# EAGLE design co2-sensor (EAGLE 9.6.2)
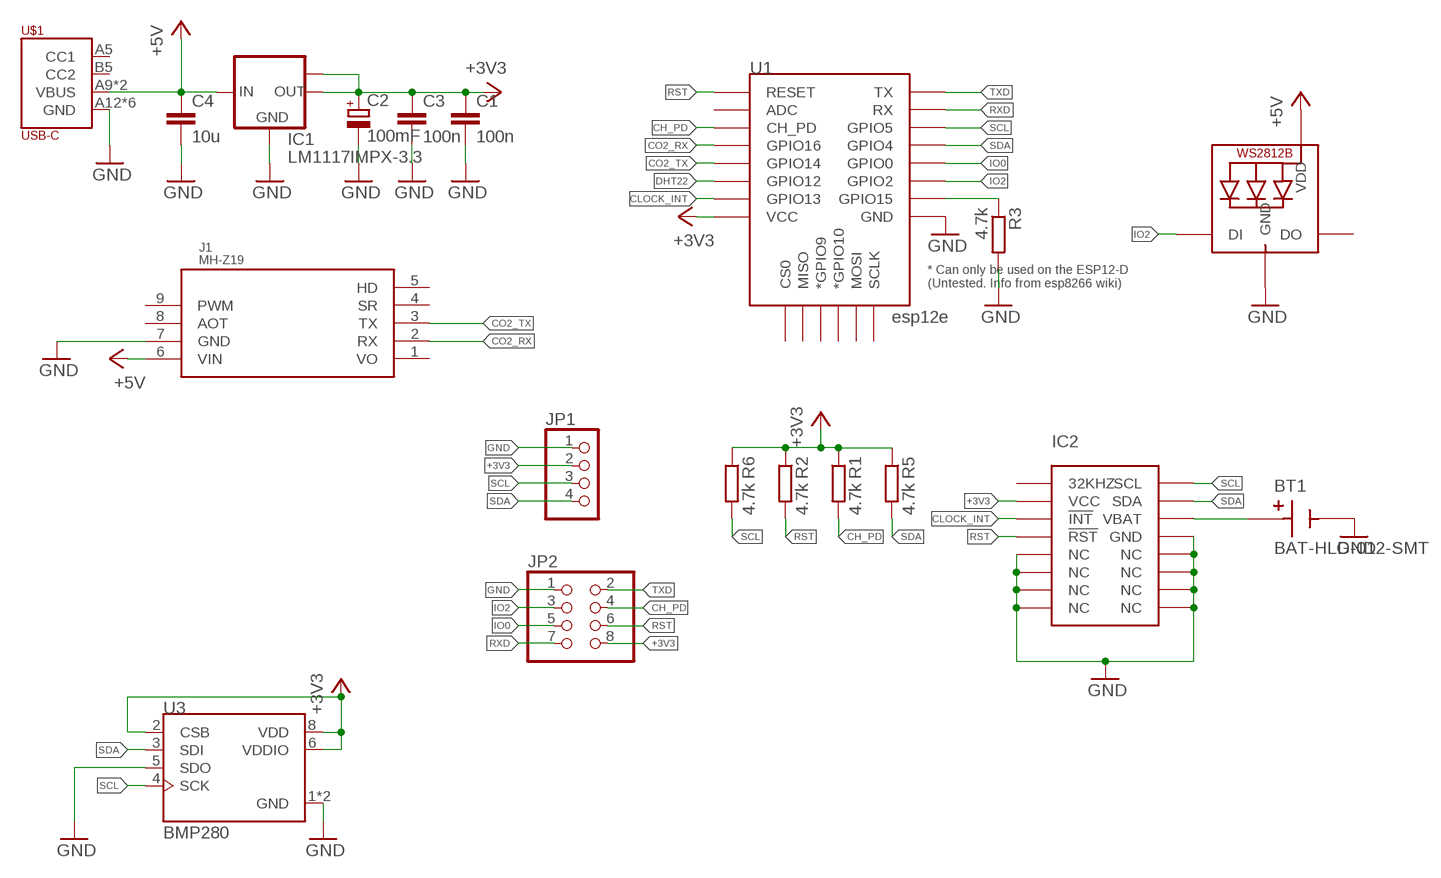
[diagram p0: schematic, sheet 1]

## Parts
BT1  BAT-HLD-012-SMT  [BAT_BAT-HLD-012-SMT]
C1  100n  C-EUC0805  [C0805]
C2  100mF  CPOL-EUCT3216  [CT3216]
C3  100n  C-EUC0805  [C0805]
C4  10u  C-EUC0805  [C0805]
IC1  LM1117IMPX-3.3  [SOT223]
IC2  DS3231SOIC-16W  [SOIC-16W]
J1  MH-Z19  [MH-Z19-REV]
JP1  PINHD-1X4  [1X04]
JP2  PINHD-2X4  [2X04]
LED1  WS2812B5050  [WS2812B]
R1  4.7k  R-EU_M0805  [M0805]
R2  4.7k  R-EU_M0805  [M0805]
R3  4.7k  R-EU_M0805  [M0805]
R5  4.7k  R-EU_M0805  [M0805]
R6  4.7k  R-EU_M0805  [M0805]
U1  esp12e  ESP12ESMD  [ESP12E-SMD]
U3  BMP280  [XDCR_BMP280]
U$1  USB-C  [USB-C]

## Nets
+3V3 [+3.3V]: C1.1 C2.+ C3.1 IC1.2(OUT) IC1.TAB(OUT1) IC2.2(VCC) JP1.2 JP2.8 R1.1 R2.1 R5.1 R6.1 U1.VCC U3.2(CSB) U3.6(VDDIO) U3.8(VDD)
+5V [+5V]: C4.1 IC1.3(IN) J1.6(VIN) LED1.1-VDD(VDD) U$1.A9(VBUS) U$1.B9(VBUS)
CH_PD: JP2.4 R1.2 U1.CH_PD
CLOCK_INT: IC2.3(!INT) U1.GPIO13
CO2_RX: J1.2(RX) U1.GPIO16
CO2_TX: J1.3(TX) U1.GPIO14
DHT22: U1.GPIO12
GND [GND]: BT1.N C1.2 C2.- C3.2 C4.2 IC1.1(GND) IC2.5(NC) IC2.6(NC) IC2.7(NC) IC2.8(NC) IC2.9(NC) IC2.10(NC) IC2.11(NC) IC2.12(NC) IC2.13(GND) J1.7(GND) JP1.1 JP2.1 LED1.3-GND(GND) R3.2 U1.GND U3.1(GND) U3.5(SDO) U3.7(GND) U$1.A12(GND) U$1.B12(GND) U$1.P$7(GND) U$1.P$8(GND) U$1.P$9(GND) U$1.P$10(GND)
IO0: JP2.5 U1.GPIO0
IO2: JP2.3 LED1.4-DIN(DI) U1.GPIO2
N$1: R3.1 U1.GPIO15
N$6: BT1.P1(P) BT1.P2(P) IC2.14(VBAT)
RST: IC2.4(!RST) JP2.6 R2.2 U1.RESET
RXD: JP2.7 U1.RXD0(RX)
SCL: IC2.16(SCL) JP1.3 R6.2 U1.GPIO5 U3.4(SCK)
SDA: IC2.15(SDA) JP1.4 R5.2 U1.GPIO4 U3.3(SDI)
TXD: JP2.2 U1.TXD0(TX)
Unconnected: IC2.1(32KHZ) J1.4(SR) J1.5(HD) J1.8(AOT) J1.9(PWM) LED1.2-DOUT(DO) U1.ADC U1.CS0 U1.GPIO9(*GPIO9) U1.GPIO10(*GPIO10) U1.MISO U1.MOSI U1.SCLK U$1.A5(CC1) U$1.B5(CC2)

## Power pins joined to a net without a drawn wire
VO: J1.1(VO)

## Library data of the parts
BT1 = BAT-HLD-012-SMT:BAT-HLD-012-SMT: Check prices <https://pricing.snapeda.com/parts/BAT-HLD-012-SMT/Linx%20Technologies/view-part?ref=eda>; AVAILABILITY: Good; DESCRIPTION: Holder for CR1216 and CR1225 Batteries, Surface-Mount, Bulk Packaging; MF: Linx Technologies; MP: BAT-HLD-012-SMT; PACKAGE: NON-STANDARD-1 Linx Technologies; PRICE: None; PURCHASE-URL: https://pricing.snapeda.com/search/part/BAT-HLD-012-SMT/?ref=eda
C1 C3 C4 = rcl:C-EU: CAPACITOR, European symbol; SPICEPREFIX: C
C2 = rcl:CPOL-EU: POLARIZED CAPACITOR, European symbol; SPICEPREFIX: C
IC1 = lm1117:LM1117IMPX-*
IC2 = DS3231_industrialberry:DS3231
J1 = mh-z19:MH-Z19: MH-Z19 - CO2 NDIR SENSOR
JP1 = pinhead:PINHD-1X4: PIN HEADER
JP2 = pinhead:PINHD-2X4: PIN HEADER
LED1 = WS2812B:WS2812B; AVAILABILITY: Unavailable; DESCRIPTION: Intelligent Control Led Integrated Light Source Pack Of 10; MF: Worldsemi; MP: WS2812B; PACKAGE: None; PRICE: None
R1-R3 R5 R6 = rcl:R-EU_: RESISTOR, European symbol; SPICEPREFIX: R
U1 = esp8266modules:ESP12E: ESP12E Module
U3 = BMP280:BMP280: BMP280 Absolute Barometric Pressure Sensor for Battery Powered Devices 2 x 2.5mm Check prices <https://pricing.snapeda.com/parts/BMP280/Bosch/view-part?ref=eda>; AVAILABILITY: Warning; DESCRIPTION: Pressure Sensor 4.35PSI ~ 15.95PSI (30kPa ~ 110kPa) Absolute 16b 8-SMD; MF: Bosch; MP: BMP280; PACKAGE: SMD-8 Bosch Sensortec; PRICE: None; PURCHASE-URL: https://pricing.snapeda.com/search/part/BMP280/?ref=eda
U$1 = USB-C:USB-C

## Net classes
0 default: width 0.25 mm, clearance 0.205 mm
1 GND: width 0.8 mm, clearance 0.205 mm to class 0, clearance 0.205 mm
2 +5V: width 0.5 mm, clearance 0.205 mm to class 0, clearance 0.205 mm to class 1, clearance 0.205 mm
3 +3.3V: width 0.5 mm, clearance 0.205 mm to class 0, clearance 0.205 mm to class 1, clearance 0.205 mm to class 2, clearance 0.205 mm

## Board
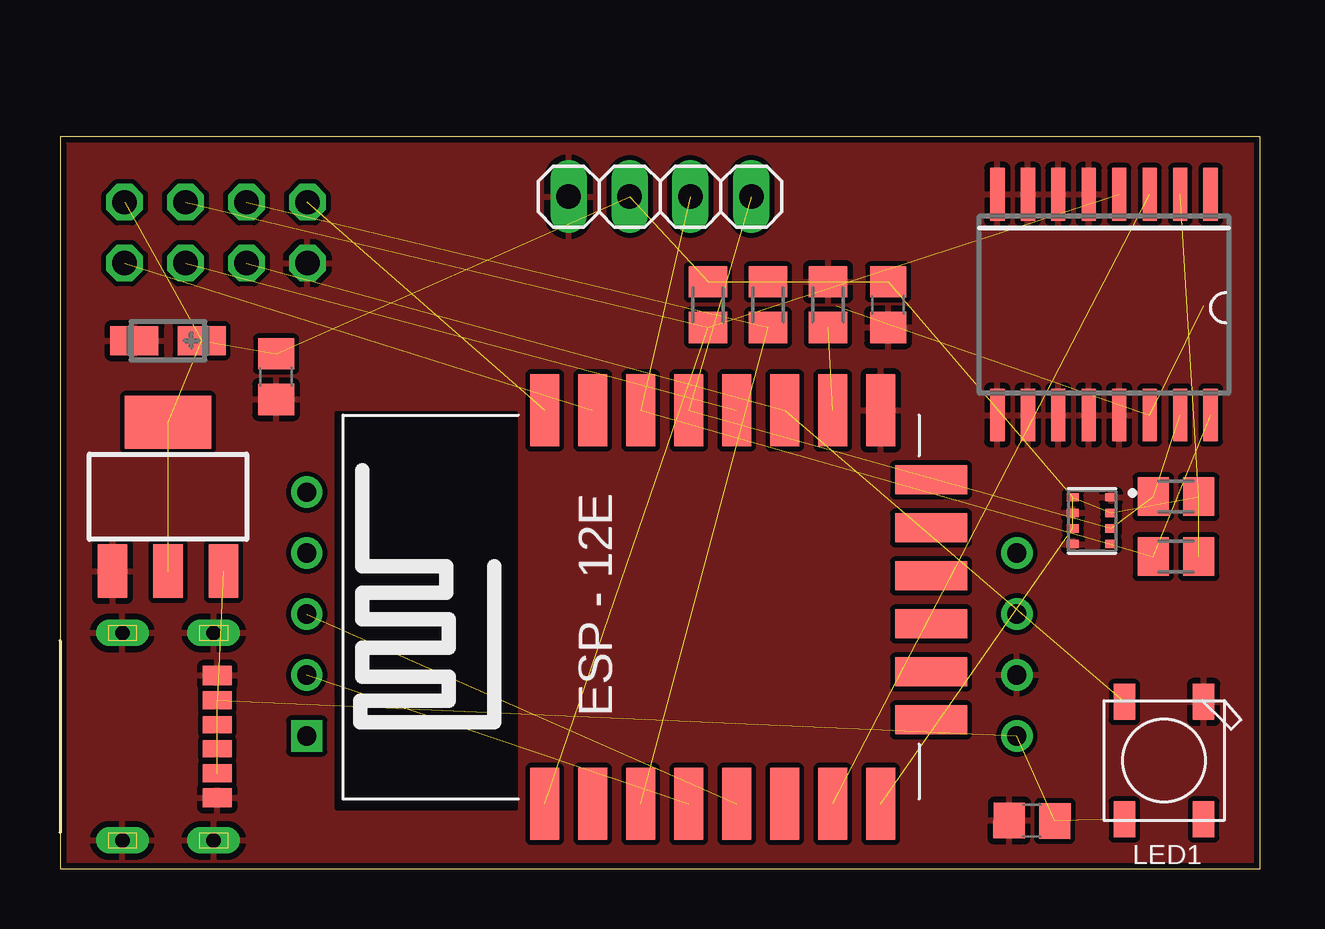
[diagram p1: board, top side]
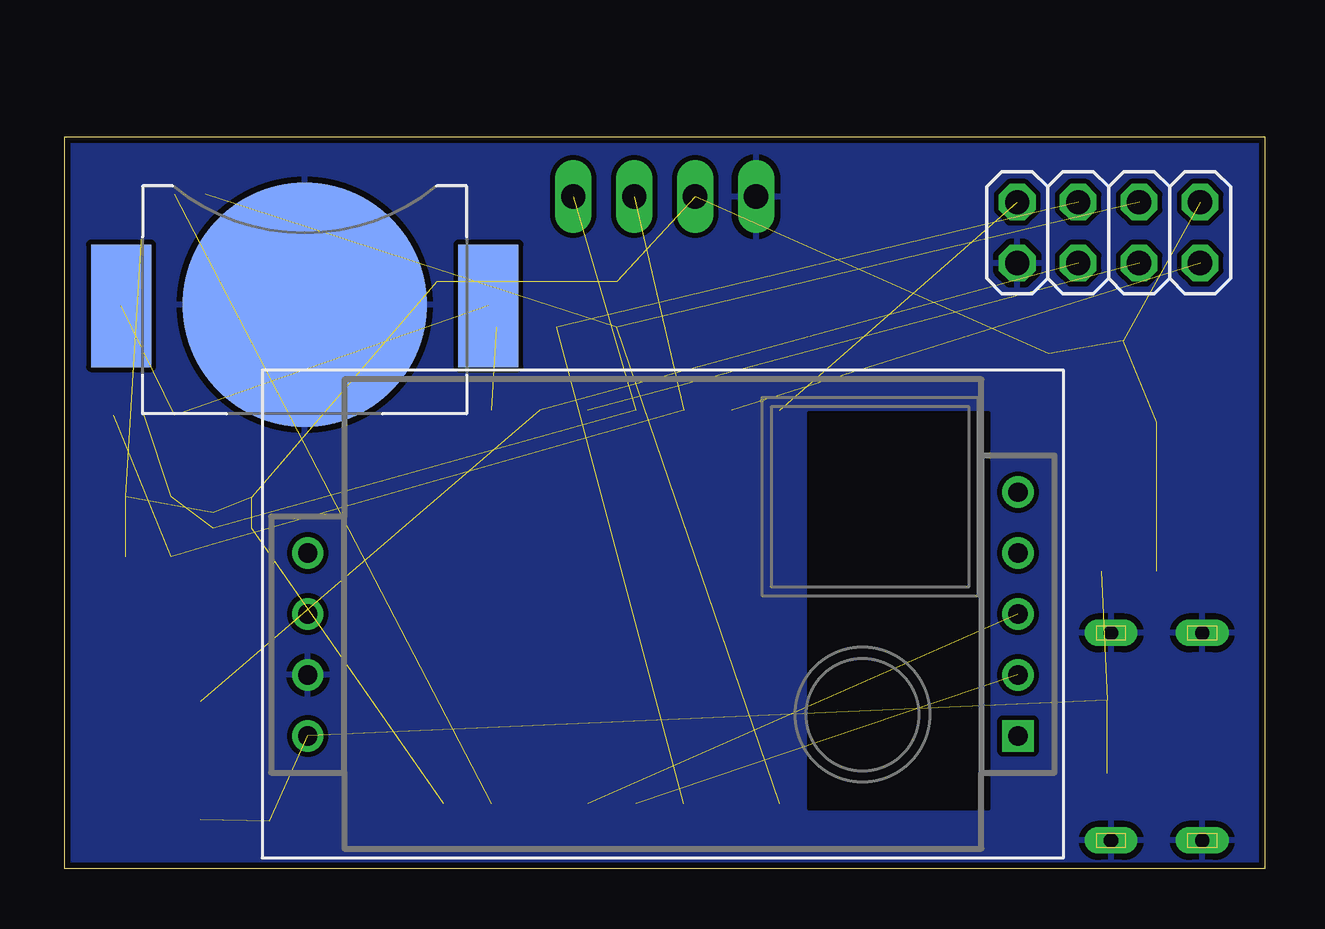
[diagram p2: board, bottom side, seen from below]

Size 50 x 30.5 mm. Coordinates in mm from the lower left corner, seen from the top.
Outline: 0,0 50,0 50,30.5 0,30.5 0,0
Copper layers (1*16): Top 0.035mm / dielectric 1.5mm / Bottom 0.035mm
Design rules "co2-sensor": minimum track width 6mil, minimum drill 12mil, track to track 0.205mm, track to pad 0.205mm, pad to pad 0.205mm, via to via 0.205mm, smd to smd 0mil, copper to edge 10mil, drill to drill 10mil, minimum pad ring 10mil, minimum via ring 6mil, stop-mask expansion 2mil, vias tented up to drill 100mil, thermal gap 10mil
tRestrict: area 11.5,2.5 to 19,19
bRestrict: area 11.5,2.5 to 19,19

### Footprints (pad centres in the part's own frame; a part is rotated, then mirrored left to right if it is on the bottom)
BAT_BAT-HLD-012-SMT = smd 10.2 x 10.2: N 0,0 | smd 2.5 x 5.1: P1 -7.65,0.05; P2 7.65,0.05
C0805 = smd 1.3 x 1.5: 1 -0.95,0; 2 0.95,0
CT3216 = smd 2 x 1.2: + -1.4,0; - 1.4,0
SOT223 = smd 1.219 x 2.235: 1 -2.311,-3.099; 2 0,-3.099; 3 2.311,-3.099 | smd 3.6 x 2.2: TAB 0,3.099
SOIC-16W = smd 0.6 x 2.2: 1 -4.445,-4.6; 2 -3.175,-4.6; 3 -1.905,-4.6; 4 -0.635,-4.6; 5 0.635,-4.6; 6 1.905,-4.6; 7 3.175,-4.6; 8 4.445,-4.6; 9 4.445,4.6; 10 3.175,4.6; 11 1.905,4.6; 12 0.635,4.6; 13 -0.635,4.6; 14 -1.905,4.6; 15 -3.175,4.6; 16 -4.445,4.6
MH-Z19-REV = drill 0.8 square: 1 9.779,-13.97 | drill 0.8: 2 9.779,-11.43; 3 9.779,-8.89; 4 9.779,-6.35; 5 9.779,-3.81; 6 39.37,-13.97; 7 39.37,-11.43; 8 39.37,-8.89; 9 39.37,-6.35
1X04 = drill 1.016 long: 1 -3.81,0; 2 -1.27,0; 3 1.27,0; 4 3.81,0
2X04 = drill 1.016 octagon: 1 -3.81,-1.27; 2 -3.81,1.27; 3 -1.27,-1.27; 4 -1.27,1.27; 5 1.27,-1.27; 6 1.27,1.27; 7 3.81,-1.27; 8 3.81,1.27
WS2812B = smd 1.5 x 0.9: 1-VDD 2.45,-1.65; 2-DOUT 2.45,1.65; 3-GND -2.45,1.65; 4-DIN -2.45,-1.65
M0805 = smd 1.3 x 1.6: 1 -0.95,0; 2 0.95,0
ESP12E-SMD = smd 3 x 1.2: ADC -8.3,3.8; CH_PD -8.3,1.8; GND 8.1,-8.2; GPIO0 8.1,-2.2; GPIO2 8.1,-4.2; GPIO4 8.1,-0.2; GPIO5 8.1,1.8; GPIO12 -8.3,-4.2; GPIO13 -8.3,-6.2; GPIO14 -8.3,-2.2; GPIO15 8.1,-6.2; GPIO16 -8.3,-0.2; RESET -8.3,5.8; RXD0 8.1,3.8; TXD0 8.1,5.8; VCC -8.3,-8.2 | smd 1.2 x 3: CS0 -4.8,-10.3; GPIO9 -0.8,-10.3; GPIO10 1.2,-10.3; MISO -2.8,-10.3; MOSI 3.2,-10.3; SCLK 5.2,-10.3
XDCR_BMP280 = smd 0.5 x 0.35: 1 0.8,0.975; 2 0.8,0.325; 3 0.8,-0.325; 4 0.8,-0.975; 5 -0.8,-0.975; 6 -0.8,-0.325; 7 -0.8,0.325; 8 -0.8,0.975
USB-C = smd 0.7 x 1.2: A5 -0.5,6.55; B5 0.5,6.55 | smd 0.76 x 1.2: A9 1.52,6.55; B9 -1.52,6.55 | smd 0.8 x 1.2: A12 2.55,6.55; B12 -2.55,6.55 | drill 0.6 pad 1.1 long: P$7 -4.32,6.4; P$8 -4.32,2.6; P$9 4.32,6.4; P$10 4.32,2.6

### Placement (x,y rotation side)
BT1  40,23.5 180 bottom
C1  9,20.5 270 top
C2  4.5,22 180 top
C3  34.5,23.5 270 top
C4  40.5,2 179.4 top
IC1  4.5,15.5 0 top
IC2  43.5,23.5 180 top
J1  0.5,19.5 0 top
JP1  25,28 0 top
JP2  6.5,26.5 0 bottom
LED1  46,4.5 270 top
R1  29.5,23.5 270 top
R2  27,23.5 270 top
R3  32,23.5 90 top
R5  46.5,15.5 180 top
R6  46.5,13 180 top
U1  26,11 90 top
U3  43,14.5 0 top
U$1  0,5.5 270 top

### Tracks (layer width: path | path; a pad name or v marks a point on that pad's centre or on a via)
+3V3  (15 unrouted)
+5V  (5 unrouted)
CH_PD  (2 unrouted)
CLOCK_INT  (1 unrouted)
CO2_RX  (1 unrouted)
CO2_TX  (1 unrouted)
GND
  pour Bottom: 0,44.5 54.5,44.5 54.5,0 0,0
  pour Top: 0,44.5 54,44.5 54,0 0,0
IO0  (1 unrouted)
IO2  (2 unrouted)
N$1  (1 unrouted)
N$6  (2 unrouted)
RST  (3 unrouted)
RXD  (1 unrouted)
SCL  (4 unrouted)
SDA  (4 unrouted)
TXD  (1 unrouted)